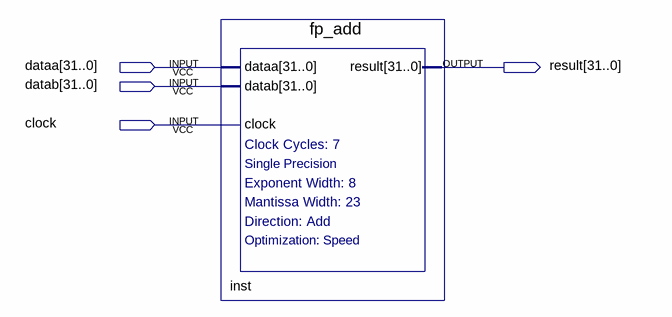
[diagram p0: schematic sheet]
// Quartus schematic FPADD.bdf as structural Verilog: 1 symbols, 4 pins
module FPADD (
  input  [31:0] dataa,
  input  [31:0] datab,
  input  clock,
  output [31:0] result
);

  fp_add inst (.dataa(dataa), .datab(datab), .clock(clock), .result(result));
endmodule
